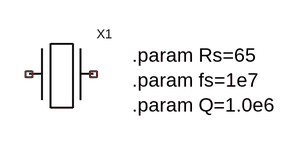
[diagram p0: schematic 03_Xtal Symbol and params.asc]
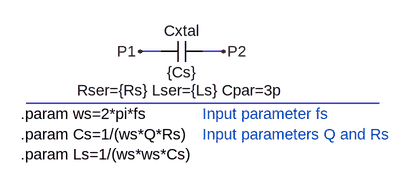
[diagram p1: sub-circuit xtal_param.asc]
03_Xtal Symbol and params.asc, the LTspice schematic file:
Version 4
SHEET 1 880 680
SYMBOL xtal_param -272 80 R0
SYMATTR InstName X1
TEXT -144 24 Left 0 !.param Rs=65\n.param fs=1e7\n.param Q=1.0e6

xtal_param.asc, the sub-circuit schematic file:
Version 4
SHEET 1 880 680
WIRE 176 144 144 144
WIRE 272 144 240 144
FLAG 144 144 P1
FLAG 272 144 P2
SYMBOL cap 240 128 R90
WINDOW 0 0 32 VBottom 0
WINDOW 3 32 32 VTop 0
WINDOW 39 60 32 VTop 0
SYMATTR InstName Cxtal
SYMATTR Value {Cs}
SYMATTR SpiceLine Rser={Rs} Lser={Ls} Cpar=3p
TEXT -40 240 Left 0 !.param ws=2*pi*fs\n.param Cs=1/(ws*Q*Rs)\n.param Ls=1/(ws*ws*Cs)
TEXT 240 240 Left 0 ;Input parameter fs\nInput parameters Q and Rs
LINE Normal 512 224 -32 224

The netlist it stands for:
* 03_Xtal Symbol and params.asc
XX1 NC_01 NC_02 xtal_param

* block symbol definitions
.subckt xtal_param P1 P2
Cxtal P2 P1 {Cs} Rser={Rs} Lser={Ls} Cpar=3p
.param ws=2*pi*fs
.param Cs=1/(ws*Q*Rs)
.param Ls=1/(ws*ws*Cs)
* Input parameter fs
* Input parameters Q and Rs
.ends xtal_param

.param Rs=65
.param fs=1e7
.param Q=1.0e6
.backanno
.end